# Altium schematic sheet 21-RGMII ETHERNET PHY - ICSSG PRG2_PRU1.SchDoc
size 513 x 386 mm
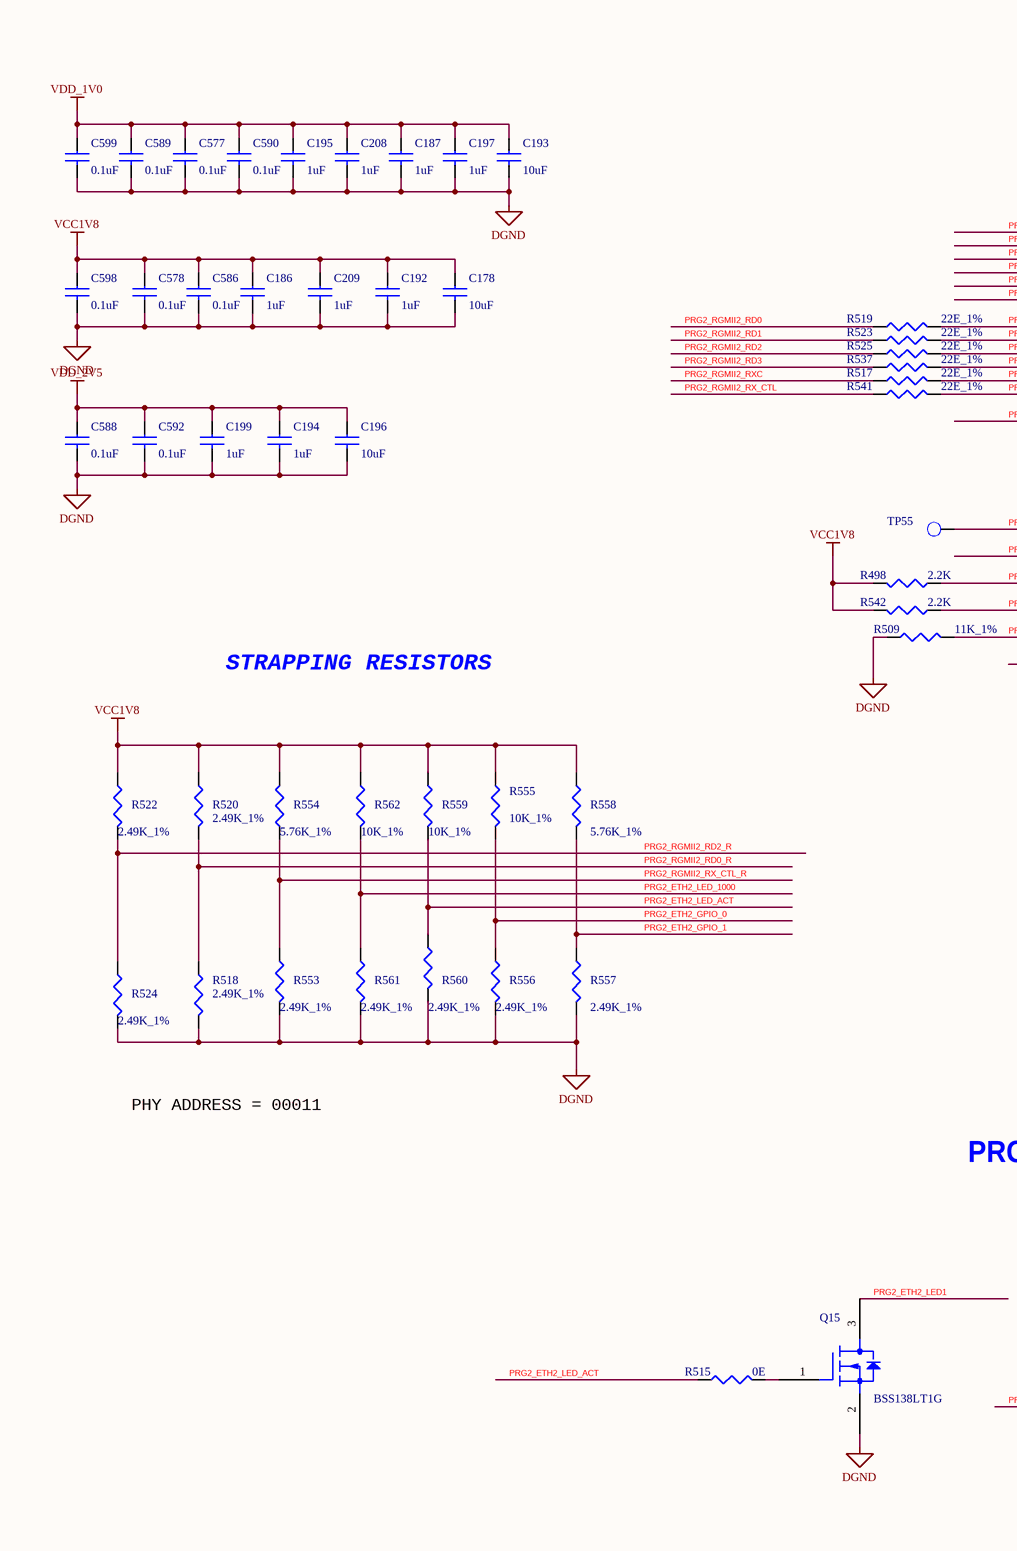
[diagram p0: 21-RGMII ETHERNET PHY - ICSSG PRG2_PRU1.SchDoc, left]
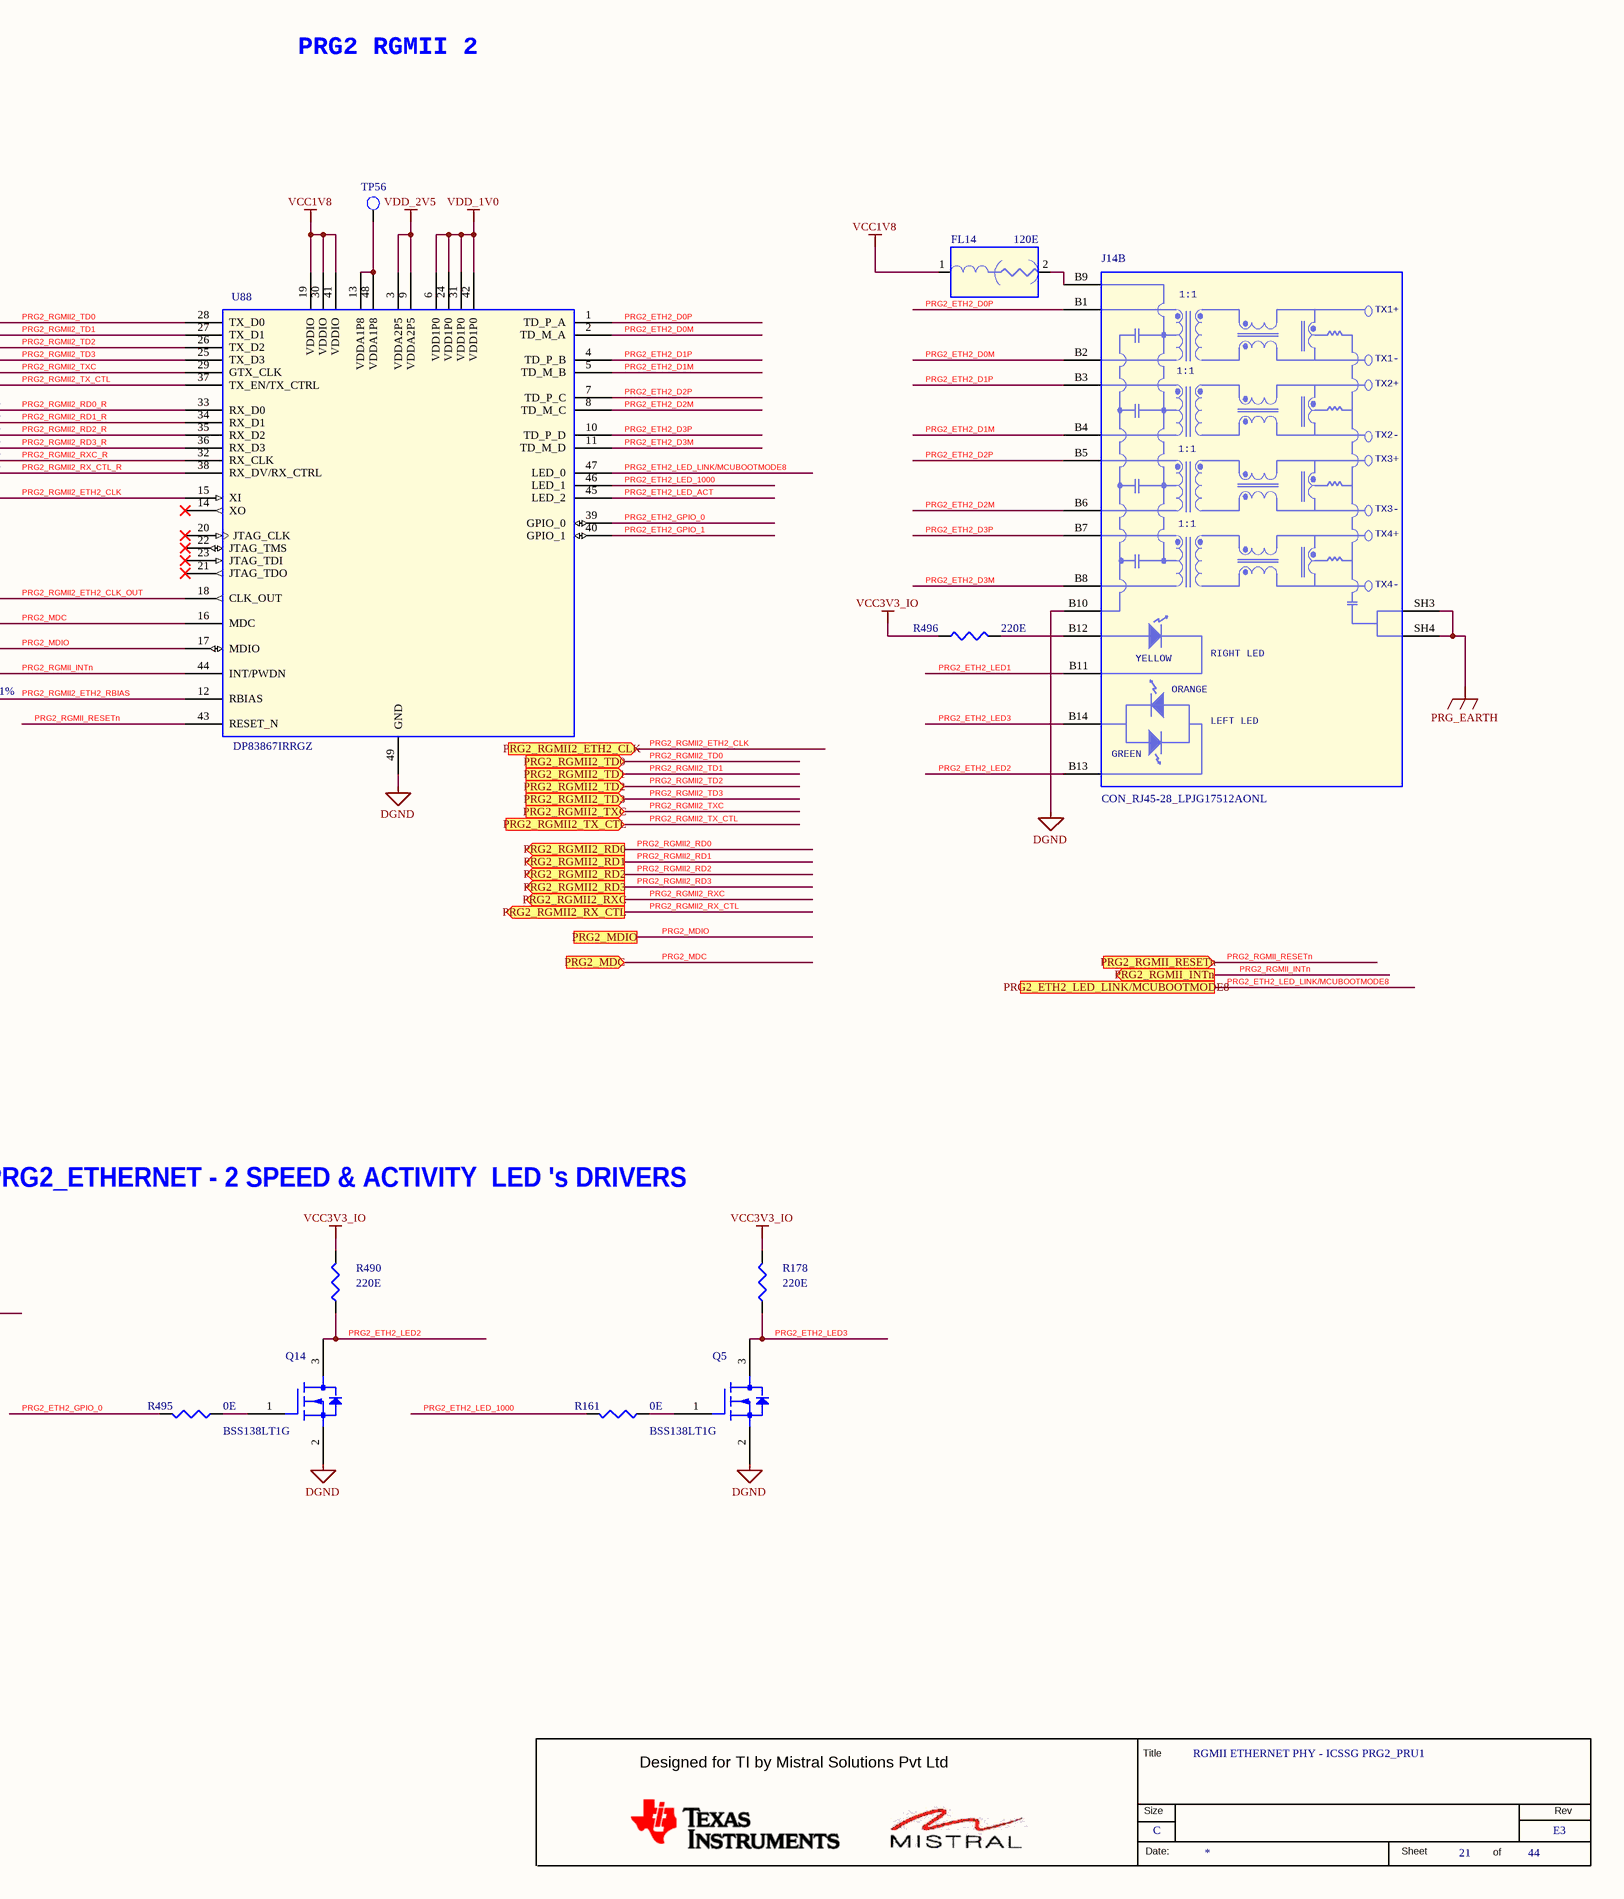
[diagram p1: 21-RGMII ETHERNET PHY - ICSSG PRG2_PRU1.SchDoc, right]

## Parts
*  RevCode: E3  Title: RGMII ETHERNET PHY - ICSSG PRG2_PRU1  Page Size: C  Page Number: 21  Page Count: 44  (hidden comment: MISTRAL_TITLEBLK_CSIZE)  (graphical)
C178  10uF  [CAP0603_1]
C186  1uF  [CAP0402_0-75]
C187  1uF  [CAP0402_0-75]
C192  1uF  [CAP0402_0-75]
C193  10uF  [CAP0603_1]
C194  1uF  [CAP0402_0-75]
C195  1uF  [CAP0402_0-75]
C196  10uF  [CAP0603_1]
C197  1uF  [CAP0402_0-75]
C199  1uF  [CAP0402_0-75]
C208  1uF  [CAP0402_0-75]
C209  1uF  [CAP0402_0-75]
C577  0.1uF  [CAP0201_0-5]
C578  0.1uF  [CAP0201_0-5]
C586  0.1uF  [CAP0201_0-5]
C588  0.1uF  [CAP0201_0-5]
C589  0.1uF  [CAP0201_0-5]
C590  0.1uF  [CAP0201_0-5]
C592  0.1uF  [CAP0201_0-5]
C598  0.1uF  [CAP0201_0-5]
C599  0.1uF  [CAP0201_0-5]
FL14  120E  [EMIFIL_BLM15A_0402_0-6]
J14  CON_RJ45-28_LPJG17512AONL  [CON_RJ45-28_LPJG17512_S_R_T_25-3]  (part B of 2)
Q5  BSS138LT1G  [SOT23-123]
Q14  BSS138LT1G  [SOT23-123]
Q15  BSS138LT1G  [SOT23-123]
R161  0E  [RES0402_0-5]
R178  220E  [RES0402_0-5]
R490  220E  [RES0402_0-5]
R495  0E  [RES0402_0-5]
R496  220E  [RES0402_0-5]
R498  2.2K  [RES0402_0-5]
R509  11K_1%  [RES0402_0-5]
R515  0E  [RES0402_0-5]
R517  22E_1%  [RES0402]
R518  2.49K_1%  [RES0402]
R519  22E_1%  [RES0402]
R520  2.49K_1%  [RES0402]
R522  2.49K_1%  [RES0402]
R523  22E_1%  [RES0402]
R524  2.49K_1%  [RES0402]
R525  22E_1%  [RES0402]
R537  22E_1%  [RES0402]
R541  22E_1%  [RES0402]
R542  2.2K  [RES0402_0-5]
R553  2.49K_1%  [RES0402]
R554  5.76K_1%  [RES0402]
R555  10K_1%  [RES0402_0-5]
R556  2.49K_1%  [RES0402]
R557  2.49K_1%  [RES0402]
R558  5.76K_1%  [RES0402]
R559  10K_1%  [RES0402_0-5]
R560  2.49K_1%  [RES0402]
R561  2.49K_1%  [RES0402]
R562  10K_1%  [RES0402_0-5]
TP55  TP40_SMD  [TP40_SMD]  (value not drawn)
TP56  TP40_SMD  [TP40_SMD]  (value not drawn)
U88  DP83867IRRGZ  [QFN48_19-68_280X280_1]

## Ports
PRG2_ETH2_LED_LINK/MCUBOOTMODE8, PRG2_MDC (in), PRG2_MDIO, PRG2_RGMII2_ETH2_CLK (in), PRG2_RGMII2_RD0 (out), PRG2_RGMII2_RD1 (out), PRG2_RGMII2_RD2 (out), PRG2_RGMII2_RD3 (out), PRG2_RGMII2_RX_CTL (out), PRG2_RGMII2_RXC (out), PRG2_RGMII2_TD0 (in), PRG2_RGMII2_TD1 (in), PRG2_RGMII2_TD2 (in), PRG2_RGMII2_TD3 (in), PRG2_RGMII2_TX_CTL (in), PRG2_RGMII2_TXC (in), PRG2_RGMII_INTn (out), PRG2_RGMII_RESETn (in)

## Nets
DGND: C178.2 C186.2 C187.2 C192.2 C193.2 C194.2 C195.2 C196.2 C197.2 C199.2 C208.2 C209.2 C577.2 C578.2 C586.2 C588.2 C589.2 C590.2 C592.2 C598.2 C599.2 J14.B10(GND) Q5.2(S) Q14.2(S) Q15.2(S) R509.2 R518.2 R524.2 R553.2 R556.2 R557.2 R560.2 R561.2 U88.49(GND)
PRG_EARTH: J14.SH3 J14.SH4
VCC1V8: C178.1 C186.1 C192.1 C209.1 C578.1 C586.1 C598.1 FL14.1 R498.2 R520.1 R522.1 R542.2 R554.2 R555.1 R558.1 R559.1 R562.1 U88.19(VDDIO) U88.30(VDDIO) U88.41(VDDIO)
VCC3V3_IO: R178.2 R490.2 R496.1
VDD_1V0: C187.1 C193.1 C195.1 C197.1 C208.1 C577.1 C589.1 C590.1 C599.1 U88.6(VDD1P0) U88.24(VDD1P0) U88.31(VDD1P0) U88.42(VDD1P0)
VDD_2V5: C194.1 C196.1 C199.1 C588.1 C592.1 U88.3(VDDA2P5) U88.9(VDDA2P5)
PRG2_ETH2_D0M: J14.B2(TD1-_2) U88.2(TD_M_A)
PRG2_ETH2_D0P: J14.B1(TD1+_2) U88.1(TD_P_A)
PRG2_ETH2_D1M: J14.B4(TD2-_2) U88.5(TD_M_B)
PRG2_ETH2_D1P: J14.B3(TD2+_2) U88.4(TD_P_B)
PRG2_ETH2_D2M: J14.B6(TD3-_2) U88.8(TD_M_C)
PRG2_ETH2_D2P: J14.B5(TD3+_2) U88.7(TD_P_C)
PRG2_ETH2_D3M: J14.B8(TD4-_2) U88.11(TD_M_D)
PRG2_ETH2_D3P: J14.B7(TD4+_2) U88.10(TD_P_D)
PRG2_ETH2_GPIO_0: R495.2 R555.2 R556.1 U88.39(GPIO_0)
PRG2_ETH2_GPIO_1: R557.1 R558.2 U88.40(GPIO_1)
PRG2_ETH2_LED1: J14.B11 Q15.3(D)
PRG2_ETH2_LED2: J14.B13 Q14.3(D) R490.1
PRG2_ETH2_LED3: J14.B14 Q5.3(D) R178.1
PRG2_ETH2_LED_1000: R161.2 R561.1 R562.2 U88.46(LED_1)
PRG2_ETH2_LED_ACT: R515.1 R559.2 R560.1 U88.45(LED_2)
PRG2_ETH2_LED_LINK/MCUBOOTMODE8: U88.47(LED_0) ; port PRG2_ETH2_LED_LINK/MCUBOOTMODE8
PRG2_MDC: U88.16(MDC) ; port PRG2_MDC
PRG2_MDIO: R498.1 U88.17(MDIO) ; port PRG2_MDIO
PRG2_RGMII2_ETH2_CLK: U88.15(XI) ; port PRG2_RGMII2_ETH2_CLK
PRG2_RGMII2_ETH2_CLK_OUT: TP55.1(TP) U88.18(CLK_OUT)
PRG2_RGMII2_ETH2_RBIAS: R509.1 U88.12(RBIAS)
PRG2_RGMII2_RD0: R519.1 ; port PRG2_RGMII2_RD0
PRG2_RGMII2_RD0_R: R518.1 R519.2 R520.2 U88.33(RX_D0)
PRG2_RGMII2_RD1: R523.1 ; port PRG2_RGMII2_RD1
PRG2_RGMII2_RD1_R: R523.2 U88.34(RX_D1)
PRG2_RGMII2_RD2: R525.1 ; port PRG2_RGMII2_RD2
PRG2_RGMII2_RD2_R: R522.2 R524.1 R525.2 U88.35(RX_D2)
PRG2_RGMII2_RD3: R537.1 ; port PRG2_RGMII2_RD3
PRG2_RGMII2_RD3_R: R537.2 U88.36(RX_D3)
PRG2_RGMII2_RX_CTL: R541.1 ; port PRG2_RGMII2_RX_CTL
PRG2_RGMII2_RX_CTL_R: R541.2 R553.1 R554.1 U88.38(RX_DV/RX_CTRL)
PRG2_RGMII2_RXC: R517.1 ; port PRG2_RGMII2_RXC
PRG2_RGMII2_RXC_R: R517.2 U88.32(RX_CLK)
PRG2_RGMII2_TD0: U88.28(TX_D0) ; port PRG2_RGMII2_TD0
PRG2_RGMII2_TD1: U88.27(TX_D1) ; port PRG2_RGMII2_TD1
PRG2_RGMII2_TD2: U88.26(TX_D2) ; port PRG2_RGMII2_TD2
PRG2_RGMII2_TD3: U88.25(TX_D3) ; port PRG2_RGMII2_TD3
PRG2_RGMII2_TX_CTL: U88.37(TX_EN/TX_CTRL) ; port PRG2_RGMII2_TX_CTL
PRG2_RGMII2_TXC: U88.29(GTX_CLK) ; port PRG2_RGMII2_TXC
PRG2_RGMII_INTn: R542.1 U88.44(INT/PWDN) ; port PRG2_RGMII_INTn
PRG2_RGMII_RESETn: U88.43(RESET_N) ; port PRG2_RGMII_RESETn
NetFL14_2: FL14.2 J14.B9(VCC)
NetJ14_B12: J14.B12 R496.2
NetQ5_1: Q5.1(G) R161.1
NetQ14_1: Q14.1(G) R495.1
NetQ15_1: Q15.1(G) R515.2
NetTP56_1: TP56.1(TP) U88.13(VDDA1P8) U88.48(VDDA1P8)

Not connected (* = marked no-connect by the designer): U88 14(XO)* 20(JTAG_CLK)* 21(JTAG_TDO)* 22(JTAG_TMS)* 23(JTAG_TDI)*

## Notes on the sheet
- PRG2 RGMII 2
- STRAPPING RESISTORS
- PHY ADDRESS = 00011
- PRG2_ETHERNET - 2 SPEED & ACTIVITY  LED 's DRIVERS
- (in symbol CON_RJ45-28_LPJG17512AONL, part B) 1:1; TX1+; TX1-; TX2+; TX2-; TX3+; TX3-; TX4+; TX4-; RIGHT LED; YELLOW; ORANGE; LEFT LED; GREEN
- (in symbol MISTRAL_TITLEBLK_CSIZE) Title; Designed for TI by Mistral Solutions Pvt Ltd; Size; Rev; Date:; Sheet; of

## Library data of the parts
* = MISTRAL_TITLEBLK_CSIZE: Issue: 1.0; Page Create Date: March  8, 1995; Page Modify Date: *
C178 = CAP_Dup5: CAP CERAMIC 10uF 10V 10% X5R 0603; Part_type: CAPACITORS\CERAMIC; Mfr_part_number: 0603ZD106KAT2A; Mfr_name: AVX CORPORATION; Mistral Part No: 120010080001-R; Wattage: NA; Custom_Duty: 15%; Customs_HS_Code: 85322990; Project: TI_MAXIE_CPB; Library Ref: CAP; MECHANICAL 3D STEP FILE: CAP0603_1; Temperature: -55°C+85°C; Weight: 2mg; Chkd/date: MANIRAJA/230118; Crtd /date: MANIRAJA/230118; Datasheet: Y:\MIS_DATABASE\DATASHEETS\CAPACITORS\AVX_MLC.PDF; Height: 0.94MM; Distributor_part_number: 478-10766-1-ND; Distributor_name: DIGIKEY; Package: 0603; Voltage: 10V; Tolerance: 10%; PCB Footprint: CAP0603_1
C186 C192 C197 C208 C209 = CAP_Dup5: CAP CERAMIC 1uF 16V 20% X5R 0402; Part_type: CAPACITORS\CERAMIC; Mfr_part_number: EMK105BJ105MV-F; Mfr_name: TAIYO YUDEN; Mistral Part No: 120018020006-R; Custom_Duty: 15%; Customs_HS_Code: 85322990; Wattage: NA; Project: TI_MAXIE_CPB; Footprint Ref: CAP0402_0-75; Library Ref: CAP; Chkd/date: MANIRAJA/150218; Crtd /date: ALVY/150218; Datasheet: Y:\MIS_DATABASE\DATASHEETS\CAPACITORS\EMK105BJ105MV-F.PDF; Temperature: -55°C+85°C; Weight: 0.65mg; Height: 0.55MM; Distributor_part_number: 587-5514-1-ND; Distributor_name: DIGIKEY; Package: 0402; Voltage: 16V; Tolerance: 20%; PCB Footprint: CAP0402_0-75; MECHANICAL 3D STEP FILE: CAP0402_0-75; Library Path: Y:\MIS_DATABASE\Library\ALTIUM_TOOL\SCHEMATICS_PARTS\MS_DISCRETE_Library.schlib; Footprint Path: Y:\MIS_DATABASE\Library\ALTIUM_TOOL\PCB_FOOTPRINTS\Altium_Footprint_Lib.PcbLib
C187 C194 C195 C199 = CAP_Dup5: CAP CERAMIC 1uF 16V 20% X5R 0402; Mistral Part No: 120018020006-R; Mfr_name: TAIYO YUDEN; Mfr_part_number: EMK105BJ105MV-F; Part_type: CAPACITORS\CERAMIC; Project: TI_MAXIE_CPB; Wattage: NA; Customs_HS_Code: 85322990; Custom_Duty: 15%; Footprint Ref: CAP0402_0-75; Library Ref: CAP; Tolerance: 20%; Voltage: 16V; Package: 0402; Distributor_name: DIGIKEY; Distributor_part_number: 587-5514-1-ND; Height: 0.55MM; Weight: 0.65mg; Temperature: -55°C+85°C; Datasheet: Y:\MIS_DATABASE\DATASHEETS\CAPACITORS\EMK105BJ105MV-F.PDF; Crtd /date: ALVY/150218; Chkd/date: MANIRAJA/150218; PCB Footprint: CAP0402_0-75; MECHANICAL 3D STEP FILE: CAP0402_0-75; Library Path: Y:\MIS_DATABASE\Library\ALTIUM_TOOL\SCHEMATICS_PARTS\MS_DISCRETE_Library.schlib; Footprint Path: Y:\MIS_DATABASE\Library\ALTIUM_TOOL\PCB_FOOTPRINTS\Altium_Footprint_Lib.PcbLib
C193 C196 = CAP_Dup5: CAP CERAMIC 10uF 10V 10% X5R 0603; Mistral Part No: 120010080001-R; Mfr_name: AVX CORPORATION; Mfr_part_number: 0603ZD106KAT2A; Part_type: CAPACITORS\CERAMIC; Wattage: NA; Project: TI_MAXIE_CPB; Customs_HS_Code: 85322990; Custom_Duty: 15%; Library Ref: CAP; MECHANICAL 3D STEP FILE: CAP0603_1; Temperature: -55°C+85°C; Weight: 2mg; Tolerance: 10%; Voltage: 10V; Package: 0603; Distributor_name: DIGIKEY; Distributor_part_number: 478-10766-1-ND; Height: 0.94MM; Datasheet: Y:\MIS_DATABASE\DATASHEETS\CAPACITORS\AVX_MLC.PDF; Crtd /date: MANIRAJA/230118; Chkd/date: MANIRAJA/230118; PCB Footprint: CAP0603_1
C577 C578 C586 C590 C592 C598 = CAP_Dup5: CAP CERAMIC 0.1uF 16V 10% X5R 0201; Part_type: CAPACITORS\CERAMIC; Mfr_part_number: GRM033R61C104KE84J; Mfr_name: MURATA; Mistral Part No: 120009030072-R; Custom_Duty: 15%; Customs_HS_Code: 85322990; Wattage: NA; Project: TI_MAXIE_CPB; Library Ref: CAP; MECHANICAL 3D STEP FILE: CAP0201_0-5; Chkd/date: MANIRAJA/120218; Crtd /date: MANIRAJA/120218; Datasheet: Y:\MIS_DATABASE\DATASHEETS\CAPACITORS\GRM033R61C104KE84.PDF; Temperature: -55°C+85°C; Weight: 0.33mg; Height: 0.33MM; Distributor_part_number: 490-16742-1-ND; Distributor_name: DIGIKEY; Package: 0201; Voltage: 16V; Tolerance: 10%; PCB Footprint: CAP0201_0-5
C588 C589 C599 = CAP_Dup5: CAP CERAMIC 0.1uF 16V 10% X5R 0201; Mistral Part No: 120009030072-R; Mfr_name: MURATA; Mfr_part_number: GRM033R61C104KE84J; Part_type: CAPACITORS\CERAMIC; Project: TI_MAXIE_CPB; Wattage: NA; Customs_HS_Code: 85322990; Custom_Duty: 15%; Library Ref: CAP; Tolerance: 10%; Voltage: 16V; Package: 0201; Distributor_name: DIGIKEY; Distributor_part_number: 490-16742-1-ND; Height: 0.33MM; Weight: 0.33mg; Temperature: -55°C+85°C; Datasheet: Y:\MIS_DATABASE\DATASHEETS\CAPACITORS\GRM033R61C104KE84.PDF; Crtd /date: MANIRAJA/120218; Chkd/date: MANIRAJA/120218; MECHANICAL 3D STEP FILE: CAP0201_0-5; PCB Footprint: CAP0201_0-5
FL14 = EMIFILTER_IND: FERRITE CHIP 120E 1.3A 0402; Part_type: MISC\FILTER; Mfr_part_number: BLM15PD121SN1; Mfr_name: MURATA; Mistral Part No: 130012030043-R; Custom_Duty: 24%; Customs_HS_Code: 85437099; Wattage: NA; Tolerance: 25%; Project: GEN_3-8; Footprint Path: Y:\MIS_DATABASE\Library\ALTIUM_TOOL\PCB_FOOTPRINTS\Altium_Footprint_Lib.PcbLib; Library Path: Y:\MIS_DATABASE\Library\ALTIUM_TOOL\SCHEMATICS_PARTS\MS_FILTER_Library.schlib; Footprint Ref: EMIFIL_BLM15A_0402_0-6; Library Ref: EMIFILTER_IND; MECHANICAL 3D STEP FILE: EMIFIL_BLM15A_0402_0-6; Chkd/date: VASANTHA/010117; Crtd /date: CHAITHANYA/150312; Datasheet: Y:\MIS_DATABASE\DATASHEETS\DISCRETES\INDUCTORS\BLM18K-SERIES.PDF; Temperature: -55°C+125°C; Weight: 0.65mg; Height: 0.55MM; Distributor_part_number: 490-5203-1-ND; Distributor_name: DIGIKEY; Package: 0402; Voltage: NA; PCB Footprint: EMIFIL_BLM15A_0402_0-6
J14 = CON_RJ45-28_LPJG17512AONL: CON JACK RJ45 28POS REGISTERED FEMALE RA TH; Mistral Part No: 150017080001-R; Mfr_name: LINK-PP; Part_type: CONNECTOR\JACK; Project: TI_SVB_DUT; Tolerance: NA; Customs_HS_Code: 85369090; Custom_Duty: 24%; Library Ref: CON_RJ45-28_LPJG17512AONL; Mfr_part_number: LPJG17512AONL; Voltage: NA; Wattage: NA; Package: THRU-HOLE; Distributor_name: NA; Distributor_part_number: NA; Height: 25.30MM; Weight: NA; Temperature: 0°C+70°C; Datasheet: Y:\MIS_DATABASE\DATASHEETS\CONNECTORS\LPJG17512AONL.PDF; Crtd /date: MANIRAJA/010817; Chkd/date: MANIRAJA/010817; MECHANICAL 3D STEP FILE: CON_RJ45-28_LPJG17512_S_R_T_25-3; PCB Footprint: CON_RJ45-28_LPJG17512_S_R_T_25-3
Q5 Q15 = MOSFET_BSS138LT1G: IC MOSFET N-CHANNEL 50V, SOT23-3; Part_type: ICS\POWER\MOSFET; Mfr_name: ON SEMICONDUCTOR; Mistral Part No: 142016040001-R; Custom_Duty: 15%; Customs_HS_Code: 85423100; Wattage: NA; Project: LRDE_ABCM; Library Ref: MOSFET_BSS138LT1G; Chkd/date: VASANTHA/150416; Crtd /date: JEBRAN/060416; Datasheet: Y:\MIS_DATABASE\DATASHEETS\DISCRETES\TRANSISTORS_FETS\BSS138LT1G.PDF; Temperature: -55°C+150°C; Weight: NA; Height: 1.11MM; Distributor_part_number: 863-BSS138LT1G; Distributor_name: MOUSER; Package: SOT23-3; Voltage: 50V; Tolerance: NA; Mfr_part_number: BSS138LT1G; PCB Footprint: SOT23-123
Q14 = MOSFET_BSS138LT1G: IC MOSFET N-CHANNEL 50V, SOT23-3; Mistral Part No: 142016040001-R; Mfr_name: ON SEMICONDUCTOR; Part_type: ICS\POWER\MOSFET; Project: LRDE_ABCM; Tolerance: NA; Customs_HS_Code: 85423100; Custom_Duty: 15%; Library Ref: MOSFET_BSS138LT1G; Mfr_part_number: BSS138LT1G; Voltage: 50V; Wattage: NA; Package: SOT23-3; Distributor_name: MOUSER; Distributor_part_number: 863-BSS138LT1G; Height: 1.11MM; Weight: NA; Temperature: -55°C+150°C; Datasheet: Y:\MIS_DATABASE\DATASHEETS\DISCRETES\TRANSISTORS_FETS\BSS138LT1G.PDF; Crtd /date: JEBRAN/060416; Chkd/date: VASANTHA/150416; PCB Footprint: SOT23-123
R161 R515 = RESISTOR_Dup4: RES 0E 1/16W 0402; Part_type: RESISTORS\FIXED; Mfr_part_number: CRCW04020000Z0ED; Mfr_name: VISHAY; Mistral Part No: 110010080019-P; Custom_Duty: 15%; Customs_HS_Code: 85332119; Voltage: NA; Project: PB_BUGBASE; Footprint Path: Y:\MIS_DATABASE\Library\ALTIUM_TOOL\PCB_FOOTPRINTS\Altium_Footprint_Lib.PcbLib; Library Path: Y:\MIS_DATABASE\Library\ALTIUM_TOOL\SCHEMATICS_PARTS\MS_DISCRETE_Library.schlib; Footprint Ref: RES0402_0-5; Library Ref: RESISTOR; MECHANICAL 3D STEP FILE: RES0402_0-5; RoHS: Pb-Free; Chkd/date: VASANTHA/201216; Crtd /date: MUDDU/190810; Datasheet: Y:\MIS_DATABASE\DATASHEETS\RESISTORS\CRCW0603.PDF; Temperature: -55°C+155°C; Weight: 0.65g/1000pcs; Height: 0.40MM; Distributor_part_number: 541-0.0JCT-ND; Distributor_name: DIGIKEY; Package: 0402; Wattage: 1/16W; Tolerance: NA; PCB Footprint: RES0402_0-5
R178 R496 = RESISTOR_Dup5: RES 220E 1/16W 5% 0402; Part_type: RESISTORS\FIXED; Mfr_part_number: ERJ-2GEJ221X; Mfr_name: PANASONIC-ECG; Mistral Part No: 110009030506-R; Voltage: NA; Custom_Duty: 15%; Customs_HS_Code: 85332119; Project: RED EYE; Footprint Path: Y:\MIS_DATABASE\Library\ALTIUM_TOOL\PCB_FOOTPRINTS\Altium_Footprint_Lib.PcbLib; Library Path: Y:\MIS_DATABASE\Library\ALTIUM_TOOL\SCHEMATICS_PARTS\MS_DISCRETE_Library.schlib; MECHANICAL 3D STEP FILE: RES0402_0-5; Temperature: -55°C+155°C; Weight: 0.8g/1000pcs; PCB Footprint: RES0402_0-5; Library Ref: RESISTOR; Chkd/date: VASANTHA/291216; Crtd /date: GEETHA/260406; Datasheet: Y:\MIS_DATABASE\DATASHEETS\RESISTORS\ERJ12.PDF; Height: 0.40MM; Distributor_part_number: P220JCT-ND; Distributor_name: DIGIKEY; Package: 0402; Wattage: 1/16W; Tolerance: 5%
R490 = RESISTOR_Dup5: RES 220E 1/16W 5% 0402; Mistral Part No: 110009030506-R; Mfr_name: PANASONIC-ECG; Mfr_part_number: ERJ-2GEJ221X; Part_type: RESISTORS\FIXED; Voltage: NA; Project: RED EYE; Customs_HS_Code: 85332119; Custom_Duty: 15%; Footprint Path: Y:\MIS_DATABASE\Library\ALTIUM_TOOL\PCB_FOOTPRINTS\Altium_Footprint_Lib.PcbLib; Library Path: Y:\MIS_DATABASE\Library\ALTIUM_TOOL\SCHEMATICS_PARTS\MS_DISCRETE_Library.schlib; MECHANICAL 3D STEP FILE: RES0402_0-5; Temperature: -55°C+155°C; Weight: 0.8g/1000pcs; PCB Footprint: RES0402_0-5; Library Ref: RESISTOR; Tolerance: 5%; Wattage: 1/16W; Package: 0402; Distributor_name: DIGIKEY; Distributor_part_number: P220JCT-ND; Height: 0.40MM; Datasheet: Y:\MIS_DATABASE\DATASHEETS\RESISTORS\ERJ12.PDF; Crtd /date: GEETHA/260406; Chkd/date: VASANTHA/291216
R495 = RESISTOR_Dup4: RES 0E 1/16W 0402; Mistral Part No: 110010080019-P; Mfr_name: VISHAY; Mfr_part_number: CRCW04020000Z0ED; Part_type: RESISTORS\FIXED; Project: PB_BUGBASE; Tolerance: NA; Customs_HS_Code: 85332119; Custom_Duty: 15%; Footprint Path: Y:\MIS_DATABASE\Library\ALTIUM_TOOL\PCB_FOOTPRINTS\Altium_Footprint_Lib.PcbLib; Library Path: Y:\MIS_DATABASE\Library\ALTIUM_TOOL\SCHEMATICS_PARTS\MS_DISCRETE_Library.schlib; Footprint Ref: RES0402_0-5; Library Ref: RESISTOR; MECHANICAL 3D STEP FILE: RES0402_0-5; Voltage: NA; Wattage: 1/16W; Package: 0402; Distributor_name: DIGIKEY; Distributor_part_number: 541-0.0JCT-ND; Height: 0.40MM; Weight: 0.65g/1000pcs; Temperature: -55°C+155°C; Datasheet: Y:\MIS_DATABASE\DATASHEETS\RESISTORS\CRCW0603.PDF; Crtd /date: MUDDU/190810; Chkd/date: VASANTHA/201216; RoHS: Pb-Free; PCB Footprint: RES0402_0-5
R498 = RESISTOR_Dup5: RES 2.2K 1/16W 5% 0402; Part_type: RESISTORS\FIXED; Mfr_part_number: RC0402JR-072K2L; Mfr_name: YAGEO AMERICA; Mistral Part No: 110010120018-R; Custom_Duty: 15%; Customs_HS_Code: 85332119; Voltage: NA; Project: TE4; NI_MARK: DNI; Library Ref: RESISTOR; Footprint Path: VALUE IS VAILABLE 3 TIMES; MECHANICAL 3D STEP FILE: RES0402_0-5; Chkd/date: VASANTHA/061216; Crtd /date: BAVISH/021210; Datasheet: Y:\MIS_DATABASE\DATASHEETS\RESISTORS\YAGEO.PDF; Temperature: -55°C+155°C; Weight: 0.65mg; Height: 0.40MM; Distributor_part_number: 311-2.2KJRCT-ND; Distributor_name: DIGIKEY; Package: 0402; Wattage: 1/16W; Tolerance: 5%; PCB Footprint: RES0402_0-5
R509 = RESISTOR_Dup5: RES 11K 1/16W 1% 0402; Part_type: RESISTORS\FIXED; Mfr_part_number: RC0402FR-0711KL; Mfr_name: YAGEO AMERICA; Mistral Part No: 110015110012-P; Custom_Duty: 15%; Customs_HS_Code: 85332119; Voltage: NA; Project: TI_VLAN_SWITCH; Library Ref: RESISTOR; MECHANICAL 3D STEP FILE: RES0402_0-5; RoHS: Pb-Free; Chkd/date: VASANTHA/251115; Crtd /date: VASANTHA/251115; Datasheet: Y:\MIS_DATABASE\DATASHEETS\RESISTORS\YAGEO-RC0402.PDF; Temperature: -55°C+155°C; Weight: 0.65mg; Height: 0.40MM; Distributor_part_number: 311-11.0KLRCT-ND; Distributor_name: DIGIKEY; Package: 0402; Wattage: 1/16W; Tolerance: 1%; PCB Footprint: RES0402_0-5
R517 R523 R537 = RESISTOR_Dup5: RES 22E 1/16W 1% 0402; Mistral Part No: 110009090004-P; Mfr_name: YAGEO AMERICA; Mfr_part_number: RC0402FR-0722RL; Part_type: RESISTORS\FIXED; Alternate_mfr_name_A: VISHAY; Alternate_mfr_part_number_A: CRCW040222R0FKED; Cust_part_number: 4700-80047E; Project: VMEFMCD; Voltage: 50V; Customs_HS_Code: 85332119; Custom_Duty: 15%; Remarks: In alternate datasheet it is RoHS COMPLIANT. Y:\MIS_DATABASE\DATASHEETS\RESISTORS\CRCW0402.PDF; Library Ref: RESISTOR; SIGNAL_MODEL: RES; Tolerance: 1%; Wattage: 1/16W; Package: 0402; Distributor_name: DIGIKEY; Distributor_part_number: 311-22.0LRCT-ND; Distributor_name_A: DIGIKEY; Distributor_part_number_A: 541-22.0LCT-ND; Height: 0.40MM; Weight: 0.8g/1000pcs; Temperature: -55°C+155°C; Datasheet: Y:\MIS_DATABASE\DATASHEETS\RESISTORS\YAGEO-RC0402.PDF; Crtd /date: MAZHAR/090909; Chkd/date: SUHAS/290910; RoHS: Pb-Free; PCB Footprint: RES0402
R518 R522 R524 R553 R560 = RESISTOR_Dup5: RES 2.49K 1/16W 1% 0402; Part_type: RESISTORS\FIXED; Mfr_part_number: RC0402FR-072K49L; Mfr_name: YAGEO AMERICA; Mistral Part No: 110016050020-R; Custom_Duty: 15%; Customs_HS_Code: 85332119; Voltage: NA; Project: TMDXCSKCC; NI_MARK: DNI; Library Ref: RESISTOR; Chkd/date: VASANTHA/270516; Crtd /date: VASANTHA/270516; Datasheet: Y:\MIS_DATABASE\DATASHEETS\RESISTORS\RC0402FR.PDF; Temperature: -55°C+155°C; Weight: NA; Height: 0.40MM; Distributor_part_number: 311-2.49KLRCT-ND; Distributor_name: DIGIKEY; Package: 0402; Wattage: 1/16W; Tolerance: 1%; PCB Footprint: RES0402
R519 R525 R541 = RESISTOR_Dup5: RES 22E 1/16W 1% 0402; Cust_part_number: 4700-80047E; Alternate_mfr_part_number_A: CRCW040222R0FKED; Alternate_mfr_name_A: VISHAY; Part_type: RESISTORS\FIXED; Mfr_part_number: RC0402FR-0722RL; Mfr_name: YAGEO AMERICA; Mistral Part No: 110009090004-P; Remarks: In alternate datasheet it is RoHS COMPLIANT. Y:\MIS_DATABASE\DATASHEETS\RESISTORS\CRCW0402.PDF; Custom_Duty: 15%; Customs_HS_Code: 85332119; Voltage: 50V; Project: VMEFMCD; Library Ref: RESISTOR; SIGNAL_MODEL: RES; RoHS: Pb-Free; Chkd/date: SUHAS/290910; Crtd /date: MAZHAR/090909; Datasheet: Y:\MIS_DATABASE\DATASHEETS\RESISTORS\YAGEO-RC0402.PDF; Temperature: -55°C+155°C; Weight: 0.8g/1000pcs; Height: 0.40MM; Distributor_part_number_A: 541-22.0LCT-ND; Distributor_name_A: DIGIKEY; Distributor_part_number: 311-22.0LRCT-ND; Distributor_name: DIGIKEY; Package: 0402; Wattage: 1/16W; Tolerance: 1%; PCB Footprint: RES0402
R520 R556 R557 R561 = RESISTOR_Dup5: RES 2.49K 1/16W 1% 0402; Mistral Part No: 110016050020-R; Mfr_name: YAGEO AMERICA; Mfr_part_number: RC0402FR-072K49L; Part_type: RESISTORS\FIXED; Project: TMDXCSKCC; Voltage: NA; Customs_HS_Code: 85332119; Custom_Duty: 15%; NI_MARK: DNI; Library Ref: RESISTOR; Tolerance: 1%; Wattage: 1/16W; Package: 0402; Distributor_name: DIGIKEY; Distributor_part_number: 311-2.49KLRCT-ND; Height: 0.40MM; Weight: NA; Temperature: -55°C+155°C; Datasheet: Y:\MIS_DATABASE\DATASHEETS\RESISTORS\RC0402FR.PDF; Crtd /date: VASANTHA/270516; Chkd/date: VASANTHA/270516; PCB Footprint: RES0402
R542 = RESISTOR_Dup5: RES 2.2K 1/16W 5% 0402; Mistral Part No: 110010120018-R; Mfr_name: YAGEO AMERICA; Mfr_part_number: RC0402JR-072K2L; Part_type: RESISTORS\FIXED; Project: TE4; Voltage: NA; Customs_HS_Code: 85332119; Custom_Duty: 15%; NI_MARK: DNI; Library Ref: RESISTOR; Tolerance: 5%; Wattage: 1/16W; Package: 0402; Distributor_name: DIGIKEY; Distributor_part_number: 311-2.2KJRCT-ND; Height: 0.40MM; Weight: 0.65mg; Temperature: -55°C+155°C; Datasheet: Y:\MIS_DATABASE\DATASHEETS\RESISTORS\YAGEO.PDF; Crtd /date: BAVISH/021210; Chkd/date: VASANTHA/061216; MECHANICAL 3D STEP FILE: RES0402_0-5; Footprint Path: VALUE IS VAILABLE 3 TIMES; PCB Footprint: RES0402_0-5
R554 = RESISTOR_Dup5: RES 5.76K 1/10W 1% 0402; Mistral Part No: 110009030945-R; Mfr_name: PANASONIC-ECG; Mfr_part_number: ERJ-2RKF5761X; Part_type: RESISTORS\FIXED; Project: CPB; Customs_HS_Code: 85332119; Custom_Duty: 15%; NI_MARK: DNI; Footprint Path: Y:\MIS_DATABASE\Library\ALTIUM_TOOL\PCB_FOOTPRINTS\Altium_Footprint_Lib.PcbLib; Library Path: Y:\MIS_DATABASE\Library\ALTIUM_TOOL\SCHEMATICS_PARTS\MS_DISCRETE_Library.schlib; Library Ref: RESISTOR; Tolerance: 1%; Wattage: 1/10W; Package: 0402; Distributor_name: DIGIKEY; Distributor_part_number: P5.76KLCT-ND; Height: 0.40MM; Datasheet: Y:\MIS_DATABASE\DATASHEETS\RESISTORS\PAN-ERJSERIES.PDF; Crtd /date: USMAN/220808; Chkd/date: MAZHAR/150709; PCB Footprint: RES0402
R555 = RESISTOR_Dup5: RES 10K 1/16W 1% 0402; Mistral Part No: 110009030220-P; Mfr_name: YAGEO AMERICA; Mfr_part_number: RC0402FR-0710KL; Part_type: RESISTORS\FIXED; Project: VOCERA; Voltage: NA; Customs_HS_Code: 85332119; Custom_Duty: 15%; NI_MARK: DNI; Footprint Path: Y:\MIS_DATABASE\Library\ALTIUM_TOOL\PCB_FOOTPRINTS\Altium_Footprint_Lib.PcbLib; Library Path: Y:\MIS_DATABASE\Library\ALTIUM_TOOL\SCHEMATICS_PARTS\MS_DISCRETE_Library.schlib; Footprint Ref: RES0402_0-5; Library Ref: RESISTOR; Tolerance: 1%; Wattage: 1/16W; Package: 0402; Distributor_name: DIGIKEY; Distributor_part_number: 311-10.0KLRTR-ND; Height: 0.40MM; Weight: 0.65mg; Temperature: -55°C+155°C; Datasheet: Y:\MIS_DATABASE\DATASHEETS\RESISTORS\YAGEO-RC0402.PDF; Crtd /date: GEETHA/290506; Chkd/date: VASANTHA/201216; RoHS: Pb-Free; MECHANICAL 3D STEP FILE: RES0402_0-5; PCB Footprint: RES0402_0-5
R558 = RESISTOR_Dup5: RES 5.76K 1/10W 1% 0402; Part_type: RESISTORS\FIXED; Mfr_part_number: ERJ-2RKF5761X; Mfr_name: PANASONIC-ECG; Mistral Part No: 110009030945-R; Custom_Duty: 15%; Customs_HS_Code: 85332119; Project: CPB; NI_MARK: DNI; Footprint Path: Y:\MIS_DATABASE\Library\ALTIUM_TOOL\PCB_FOOTPRINTS\Altium_Footprint_Lib.PcbLib; Library Path: Y:\MIS_DATABASE\Library\ALTIUM_TOOL\SCHEMATICS_PARTS\MS_DISCRETE_Library.schlib; Library Ref: RESISTOR; Chkd/date: MAZHAR/150709; Crtd /date: USMAN/220808; Datasheet: Y:\MIS_DATABASE\DATASHEETS\RESISTORS\PAN-ERJSERIES.PDF; Height: 0.40MM; Distributor_part_number: P5.76KLCT-ND; Distributor_name: DIGIKEY; Package: 0402; Wattage: 1/10W; Tolerance: 1%; PCB Footprint: RES0402
R559 R562 = RESISTOR_Dup5: RES 10K 1/16W 1% 0402; Part_type: RESISTORS\FIXED; Mfr_part_number: RC0402FR-0710KL; Mfr_name: YAGEO AMERICA; Mistral Part No: 110009030220-P; Custom_Duty: 15%; Customs_HS_Code: 85332119; Voltage: NA; Project: VOCERA; NI_MARK: DNI; Footprint Path: Y:\MIS_DATABASE\Library\ALTIUM_TOOL\PCB_FOOTPRINTS\Altium_Footprint_Lib.PcbLib; Library Path: Y:\MIS_DATABASE\Library\ALTIUM_TOOL\SCHEMATICS_PARTS\MS_DISCRETE_Library.schlib; Footprint Ref: RES0402_0-5; Library Ref: RESISTOR; MECHANICAL 3D STEP FILE: RES0402_0-5; RoHS: Pb-Free; Chkd/date: VASANTHA/201216; Crtd /date: GEETHA/290506; Datasheet: Y:\MIS_DATABASE\DATASHEETS\RESISTORS\YAGEO-RC0402.PDF; Temperature: -55°C+155°C; Weight: 0.65mg; Height: 0.40MM; Distributor_part_number: 311-10.0KLRTR-ND; Distributor_name: DIGIKEY; Package: 0402; Wattage: 1/16W; Tolerance: 1%; PCB Footprint: RES0402_0-5
TP55 = TESTPOINT: TESTPOINT CIR 40 SMD; Mistral Part No: 130009030933; Mfr_name: LOCAL; MECHANICAL 3D STEP FILE: NA; Project: RAINIER-3; NI_MARK: DNI; RoHS: NA; Footprint Ref: TP40_SMD; Library Ref: TESTPOINT; Footprint Path: Y:\MIS_DATABASE\Library\ALTIUM_TOOL\PCB_FOOTPRINTS\Altium_Footprint_Lib.PcbLib; Library Path: Y:\MIS_DATABASE\Library\ALTIUM_TOOL\SCHEMATICS_PARTS\MS_DISCRETE_Library.schlib; Datasheet: NA; Temperature: NA; Weight: NA; Wattage: NA; Voltage: NA; Tolerance: NA; Mfr_part_number: TP40_SMD; Part_type: TESTPOINT; Package: SMD; Distributor_name: NA; Distributor_part_number: NA; Height: NA; Crtd /date: MAZHAR/190505; Chkd/date: MAZHAR/190505; PCB Footprint: TP40_SMD
TP56 = TESTPOINT: TESTPOINT CIR 40 SMD; Mistral Part No: 130009030933; Mfr_name: LOCAL; Project: RAINIER-3; Tolerance: NA; NI_MARK: DNI; RoHS: NA; Footprint Ref: TP40_SMD; Library Ref: TESTPOINT; Mfr_part_number: TP40_SMD; Part_type: TESTPOINT; Package: SMD; Distributor_name: NA; Distributor_part_number: NA; Height: NA; Crtd /date: MAZHAR/190505; Chkd/date: MAZHAR/190505; Voltage: NA; Wattage: NA; Weight: NA; Temperature: NA; Datasheet: NA; MECHANICAL 3D STEP FILE: NA; Library Path: Y:\MIS_DATABASE\Library\ALTIUM_TOOL\SCHEMATICS_PARTS\MS_DISCRETE_Library.schlib; Footprint Path: Y:\MIS_DATABASE\Library\ALTIUM_TOOL\PCB_FOOTPRINTS\Altium_Footprint_Lib.PcbLib; PCB Footprint: TP40_SMD
U88 = DP83867IRRGZ_VQFN48: IC HIGH IMMUNITY 10/100/1000 Mb/s ETHERNET PHY LAYER TRANSCEIVER VQFN48; Mistral Part No: 143017080002-R; Mfr_name: TEXAS INSTRUMENTS; Part_type: ICS\TELECOM\TRANSCEIVER; Project: TI_SVB_CONTROLLER CARD; Tolerance: NA; Customs_HS_Code: 85423100; Custom_Duty: 15%; Library Ref: DP83867IRRGZ_VQFN48; Mfr_part_number: DP83867IRRGZ; Voltage: NA; Wattage: NA; Package: VQFN48; Distributor_name: DIGIKEY; Distributor_part_number: DP83867IRRGZT-ND; Height: 1.00MM; Weight: NA; Temperature: -40°C+85°C; Datasheet: Y:\MIS_DATABASE\DATASHEETS\ICS\DIGITAL\BUSTRANSCEIVER\DP83867I.PDF; Crtd /date: MANIRAJA/110817; Chkd/date: MANIRAJA/110817; MECHANICAL 3D STEP FILE: QFN48_19-68_280X280_1; PCB Footprint: QFN48_19-68_280X280_1